# Altium schematic sheet SCH_MODULO_CARGA.SchDoc
size A4
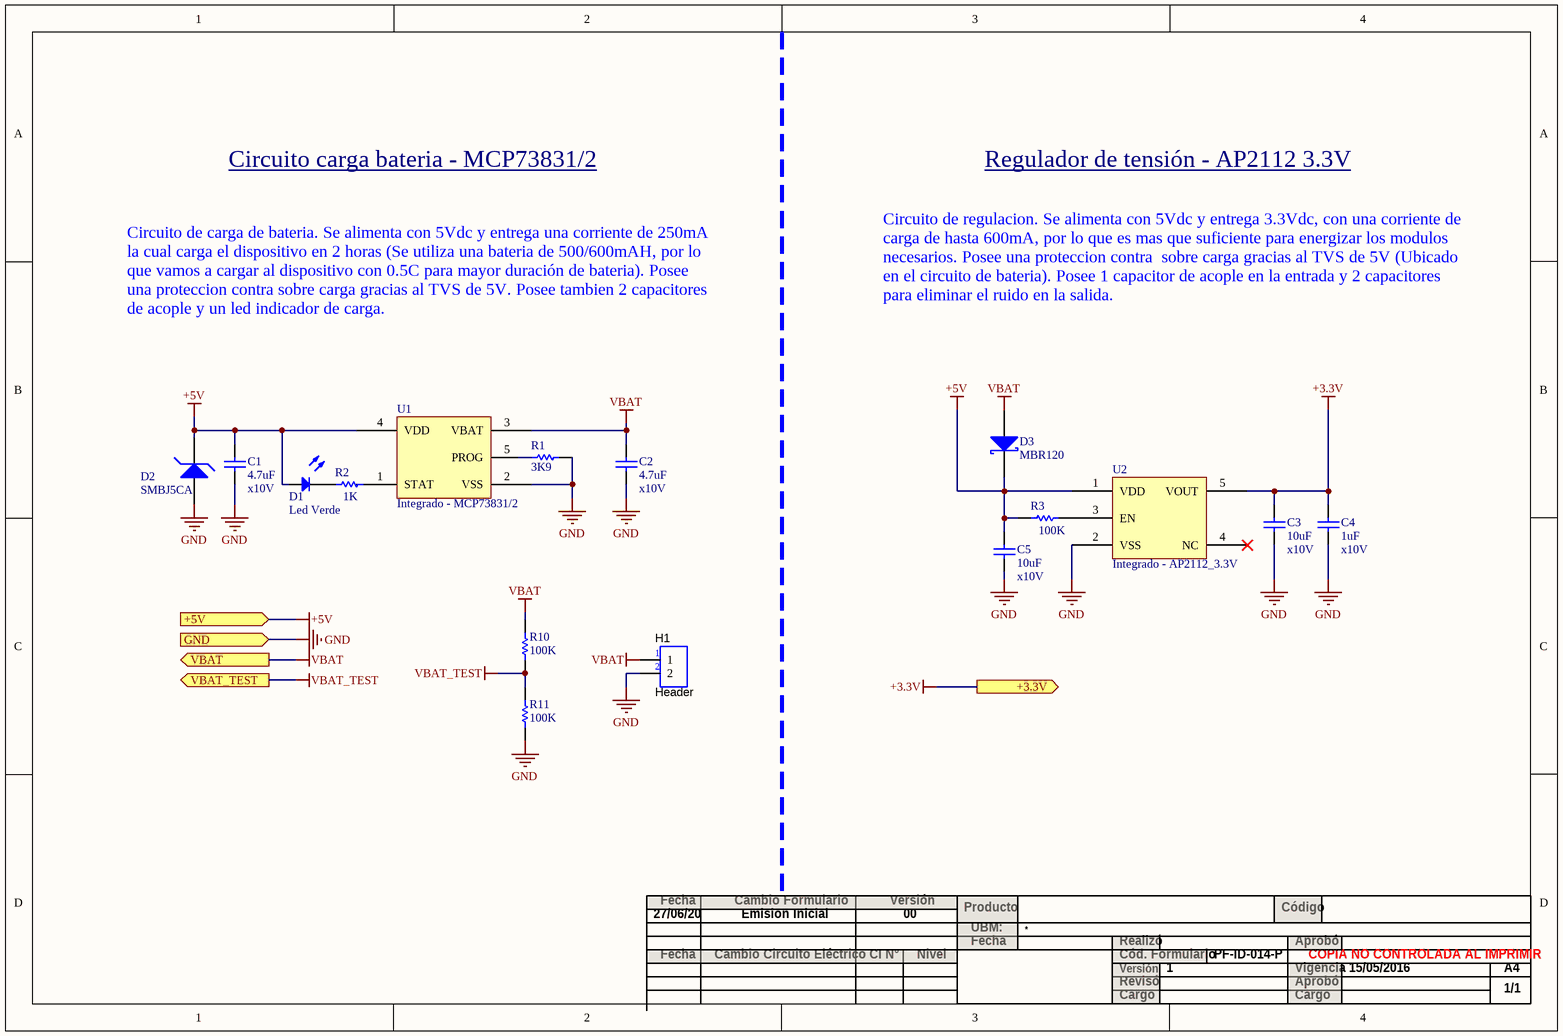
[diagram p0: SCH_MODULO_CARGA.SchDoc]

## Parts
C1  value 4.7uF  Voltage: x10V  [RAD-0.3]  (hidden comment: Capacitor - Común)
C2  value 4.7uF  Voltage: x10V  [RAD-0.3]  (hidden comment: Capacitor - Común)
C3  value 10uF  Voltage: x10V  [RAD-0.3]  (hidden comment: Capacitor - Común)
C4  value 1uF  Voltage: x10V  [RAD-0.3]  (hidden comment: Capacitor - Común)
C5  value 10uF  Voltage: x10V  [RAD-0.3]  (hidden comment: Capacitor - Común)
D1  Led Verde  [LED-0]
D2  SMBJ5CA  [SMC]
D3  MBR120  [SMB]
H1  Header  [HDR_1x2_Offset]  (no BOM)
R1  value 3K9  [Res_0603]  (hidden comment: Resistencia - Común)
R2  value 1K  [Res_0603]  (hidden comment: Resistencia - Común)
R3  value 100K  [Res_0603]  (hidden comment: Resistencia - Común)
R10  value 100K  [AXIAL-0.5]  (hidden comment: Resistencia - Común)
R11  value 100K  [AXIAL-0.5]  (hidden comment: Resistencia - Común)
U1  Integrado - MCP73831/2  [SOT23-5]
U2  Integrado - AP2112_3.3V  [SOT23-5]

## Ports
+3.3V (out), +5V (in), GND (in), VBAT (out), VBAT_TEST (out)

## Nets
+3.3V: C3.2 C4.2 U2.5(VOUT) ; port +3.3V
+5V: C1.1 C5.2 D1.1(A) D2.2(K) D3.2(K) R3.1 U1.4(VDD) U2.1(VDD) ; port +5V
GND: C1.2 C2.1 C3.1 C4.1 C5.1 D2.1(A) H1.2 R1.2 R11.1 U1.2(VSS) U2.2(VSS) ; port GND
VBAT: C2.2 D3.1(A) H1.1 R10.2 U1.3(VBAT) ; port VBAT
VBAT_TEST: R10.1 R11.2 ; port VBAT_TEST
NetD1_2: D1.2(K) R2.1
NetR1_1: R1.1 U1.5(PROG)
NetR3_2: R3.2 U2.3(EN)

Not connected (* = marked no-connect by the designer): R2 2; U1 1(STAT); U2 4(NC)*

## Notes on the sheet
- Circuito carga bateria - MCP73831/2
- Regulador de tensión - AP2112 3.3V
- Circuito de carga de bateria. Se alimenta con 5Vdc y entrega una corriente de 250mA la cual carga el dispositivo en 2 horas (Se utiliza una bateria de 500/600mAH, por lo que vamos a cargar al dispositivo con 0.5C para mayor duración de bateria). Posee una proteccion contra sobre carga gracias al TVS de 5V. Posee tambien 2 capacitores de acople y un led indicador de carga.
- Circuito de regulacion. Se alimenta con 5Vdc y entrega 3.3Vdc, con una corriente de carga de hasta 600mA, por lo que es mas que suficiente para energizar los modulos necesarios. Posee una proteccion contra  sobre carga gracias al TVS de 5V (Ubicado en el circuito de bateria). Posee 1 capacitor de acople en la entrada y 2 capacitores para eliminar el ruido en la salida.
- 27/06/20
- Fecha
- Cambio Formulario
- Emision Inicial
- Versión
- 00
- Producto
- Código
- Cambio Circuito Eléctrico
- CI N°
- Nivel
- UBM:
- Revisó
- Cód. Formulario
- Realizó
- 1
- PF-ID-014-P
- Aprobó
- Vigencia
- COPIA NO CONTROLADA AL IMPRIMIR
- 15/05/2016
- A4
- Cargo
- 1/1

## Library data of the parts
C1-C5 = Capacitor - Común: Capacitor; Published: 8-Jun-2000; LatestRevisionDate: 17-Jul-2002; LatestRevisionNote: Re-released for DXP Platform.; PackageReference: RAD-0.3; Publisher: Altium Limited; PackageDescription: Radial Cap, Thru-Hole; 2 Leads; 0.3 in Pin Spacing
D1 = Diodo - LED: Diodo Led; Published: 8-Jun-2000; LatestRevisionDate: 08-Jul-2005; LatestRevisionNote: Mech Layer 1 removed.; PackageReference: LED-0; Publisher: Altium Limited; PackageDescription: LED; 2 Leads
D2 = Diodo - TVS: Default Diode; Published: 8-Jun-2000; LatestRevisionDate: 17-Jul-2002; LatestRevisionNote: Re-released for DXP Platform.; PackageVersion: Sep-1996; PackageReference: SMC; Publisher: Altium Limited; PackageDescription: DO-214-AB/SMC; 2 C-Bend Leads; Body 7.9 x 5.9 mm, inc. leads (LxW); Code_JEDEC: DO-214-AB
D3 = Diodo - Schottky: Schottky Diode; Published: 8-Jun-2000; LatestRevisionDate: 17-Jul-2002; LatestRevisionNote: Re-released for DXP Platform.; PackageReference: SMB; Publisher: Altium Limited; PackageDescription: DO-214-AA/SMB; 2 C-Bend Leads; Body 5.3 x 3.6 mm, inc. leads (LxW); Code_JEDEC: DO-214-AA
H1 = Conector - 2 Pos: Header, 2-pin
R1-R3 R10 R11 = Resistencia - Común: Semiconductor Resistor; Published: 8-Jun-2000; LatestRevisionDate: 17-Jul-2002; LatestRevisionNote: Re-released for DXP Platform.; PackageReference: AXIAL-0.5; Publisher: Altium Limited; PackageDescription: Axial Device, Thru-Hole; 2 Leads; 0.5 in Pin Spacing
U1 = Integrado - MCP73831/2: Cargador bateria Litio 3,7V
U2 = Integrado - AP2112_3.3V: Regulador 3.3V 600mA